# Altium schematic sheet wifi.SchDoc
size A4; DrawnBy: Van Tuan Ngo; Organization: PIF Club; Address1: 304B1, HCMUT,; Address2: Ly Thuong Kiet St.,; Address3: District 10, HCM, VN; DocumentNumber: 6; Revision: 1.0.0; SheetNumber: 6; SheetTotal: 8; Project: PIFWRobot
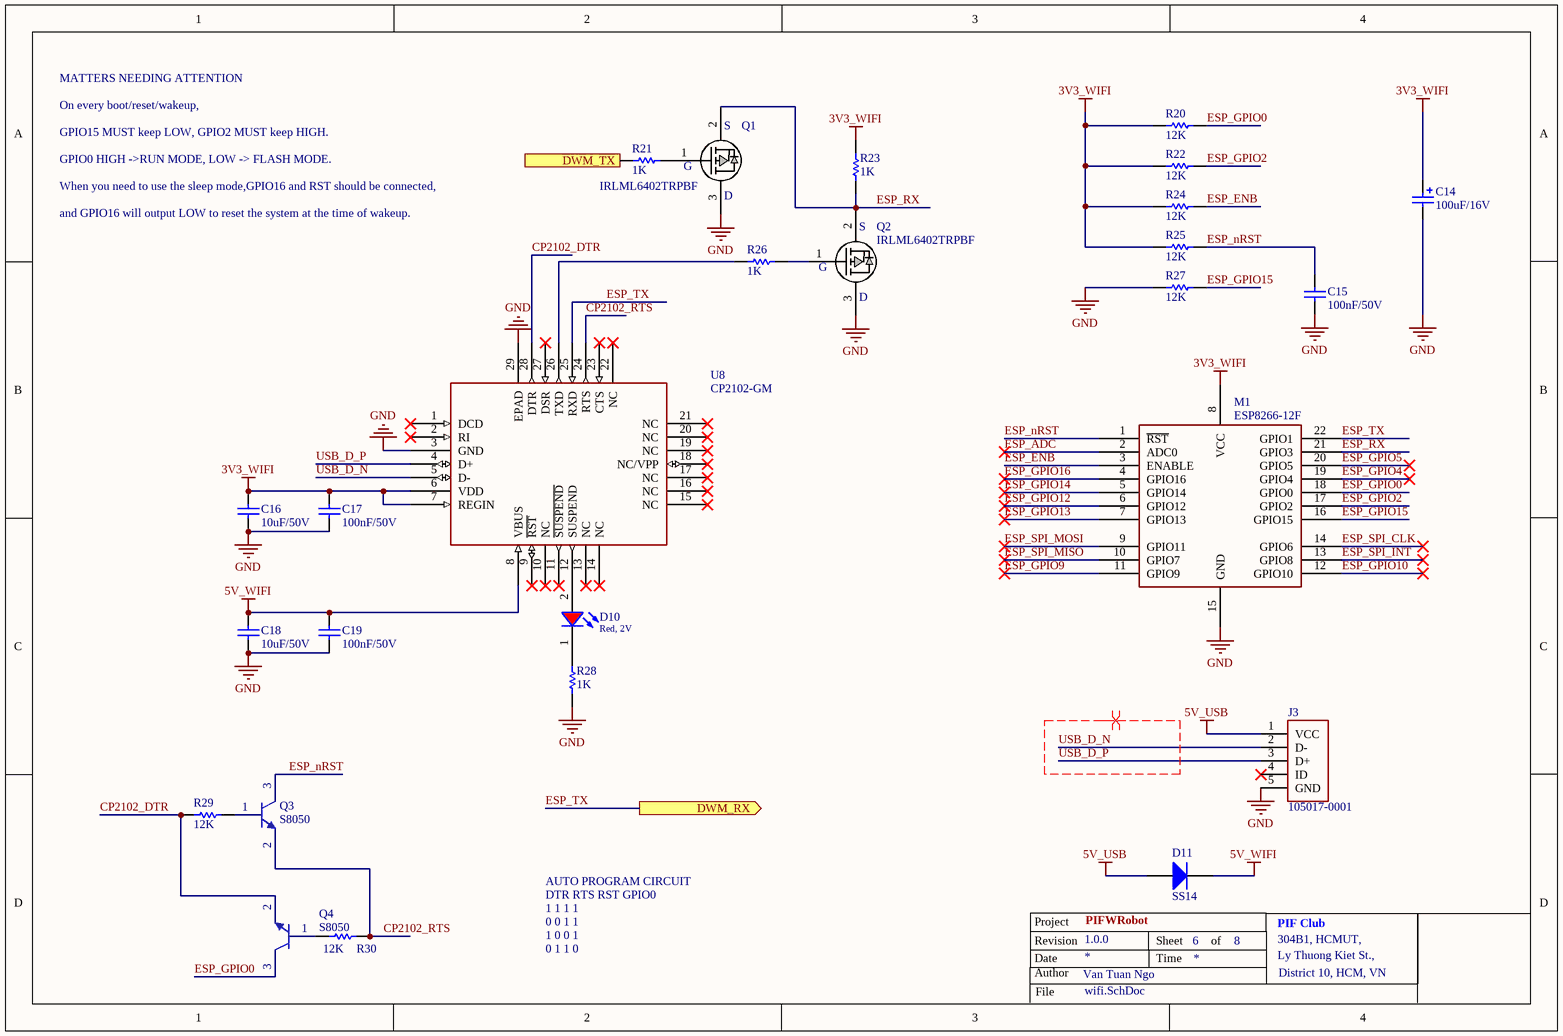
[diagram p0: wifi.SchDoc]

## Parts
C14  value 100uF/16V  [CAP_SM_TAN]  (hidden comment: TAJB107M006RNJ)
C15  value 100nF/50V  [CAP-SM-0805]  (hidden comment: Cap-100nF-50V-0805)
C16  value 10uF/50V  [CAP-SM-0805]  (hidden comment: Cap-10uF-50V-0805)
C17  value 100nF/50V  [CAP-SM-0805]  (hidden comment: Cap-100nF-50V-0805)
C18  value 10uF/50V  [CAP-SM-0805]  (hidden comment: Cap-10uF-50V-0805)
C19  value 100nF/50V  [CAP-SM-0805]  (hidden comment: Cap-100nF-50V-0805)
D10  Red, 2V  [WL-SMCW_0805]
D11  SS14  [SS14]
J3  105017-0001  [Micro-USB-Female]
M1  ESP8266-12F  [ESP8266-12F]
Q1  IRLML6402TRPBF  [SOT23_NEX]
Q2  IRLML6402TRPBF  [SOT23_NEX]
Q3  S8050  [SOT23_NEX]
Q4  S8050  [SOT23_NEX]
R20  value 12K  [RES-SM-0805]  (hidden comment: Res-12K-0805)
R21  value 1K  [RES-SM-0805]  (hidden comment: Res-1K-0805)
R22  value 12K  [RES-SM-0805]  (hidden comment: Res-12K-0805)
R23  value 1K  [RES-SM-0805]  (hidden comment: Res-1K-0805)
R24  value 12K  [RES-SM-0805]  (hidden comment: Res-12K-0805)
R25  value 12K  [RES-SM-0805]  (hidden comment: Res-12K-0805)
R26  value 1K  [RES-SM-0805]  (hidden comment: Res-1K-0805)
R27  value 12K  [RES-SM-0805]  (hidden comment: Res-12K-0805)
R28  value 1K  [RES-SM-0805]  (hidden comment: Res-1K-0805)
R29  value 12K  [RES-SM-0805]  (hidden comment: Res-12K-0805)
R30  value 12K  [RES-SM-0805]  (hidden comment: Res-12K-0805)
U8  CP2102-GM  [QFN28_5X5_SIL]

## Ports
DWM_RX (out), DWM_TX (in)

## Nets
3V3_WIFI: C14.1 C16.2 C17.2 M1.8(VCC) R20.1 R22.1 R23.2 R24.1 R25.1 U8.6(VDD) U8.7(REGIN)
5V_USB: D11.2(A) J3.1(VCC)
5V_WIFI: C18.2 C19.2 D11.1(K) U8.8(VBUS)
GND: C14.2 C15.1 C16.1 C17.1 C18.1 C19.1 J3.5(GND) M1.15(GND) Q1.3(D) Q2.3(D) R27.1 R28.1 U8.3(GND) U8.29(EPAD)
CP2102_DTR: Q4.2(E) R29.1 U8.28(DTR)
CP2102_RTS: Q3.2(E) R30.2 U8.24(RTS)
DWM_TX: R21.1 ; port DWM_TX
ESP_ADC: M1.2(ADC0)
ESP_ENB: M1.3(ENABLE) R24.2
ESP_GPIO0: M1.18(GPIO0) Q4.3(C) R20.2
ESP_GPIO2: M1.17(GPIO2) R22.2
ESP_GPIO4: M1.19(GPIO4)
ESP_GPIO5: M1.20(GPIO5)
ESP_GPIO9: M1.11(GPIO9)
ESP_GPIO10: M1.12(GPIO10)
ESP_GPIO12: M1.6(GPIO12)
ESP_GPIO13: M1.7(GPIO13)
ESP_GPIO14: M1.5(GPIO14)
ESP_GPIO15: M1.16(GPIO15) R27.2
ESP_GPIO16: M1.4(GPIO16)
ESP_nRST: C15.2 M1.1(~{RST}) Q3.3(C) R25.2
ESP_RX: M1.21(GPIO3) Q1.2(S) Q2.2(S) R23.1
ESP_SPI_CLK: M1.14(GPIO6)
ESP_SPI_INT: M1.13(GPIO8)
ESP_SPI_MISO: M1.10(GPIO7)
ESP_SPI_MOSI: M1.9(GPIO11)
ESP_TX: M1.22(GPIO1) U8.25(RXD) ; port DWM_RX
USB_D_N: J3.2(D-) U8.5(D-)
USB_D_P: J3.3(D+) U8.4(D+)
NetD10_1: D10.1(K) R28.2
NetD10_2: D10.2(A) U8.12(SUSPEND)
NetQ1_1: Q1.1(G) R21.2
NetQ2_1: Q2.1(G) R26.2
NetQ3_1: Q3.1(B) R29.2
NetQ4_1: Q4.1(B) R30.1
NetR26_1: R26.1 U8.26(TXD)

Not connected (* = marked no-connect by the designer): J3 4(ID)*; U8 1(DCD)* 2(RI)* 9(~{RST})* 10(NC)* 11(~{SUSPEND})* 13(NC)* 14(NC)* 15(NC)* 16(NC)* 17(NC)* 18(NC/VPP)* 19(NC)* 20(NC)* 21(NC)* 22(NC)* 23(CTS)* 27(DSR)*

## Layout directives
differential pair: USB_D_N, USB_D_P

## Notes on the sheet
- MATTERS NEEDING ATTENTION
- On every boot/reset/wakeup,
- GPIO15 MUST keep LOW, GPIO2 MUST keep HIGH.
- GPIO0 HIGH ->RUN MODE, LOW -> FLASH MODE.
- When you need to use the sleep mode,GPIO16 and RST should be connected,
- and GPIO16 will output LOW to reset the system at the time of wakeup.
- AUTO PROGRAM CIRCUIT
- DTR RTS RST GPIO0
- 1 1 1 1
- 0 0 1 1
- 1 0 0 1
- 0 1 1 0
- Project
- Revision
- Date
- Author
- Sheet
- Time
- of
- File

## Library data of the parts
C14 = Cap-Tan-100uF-16V: Manufacturer: Nichicon; Manufacturer Part Number: UWX1C101MCL1GB; Local Supplier: thegioiic; Local Supplier Link: https://www.thegioiic.com/products/tu-tantalum-100uf-16v-2312-tajc107k016rnj; Supplier 1: Digikey; Supplier 1 Part Number: 493-2105-1-ND; Supplier 1 Link: https://www.digikey.com/product-detail/en/nichicon/UWX1C101MCL1GB/493-2105-1-ND/590080
C15 C17 C19 = Cap-100nF-50V-0805: CAP CER 0.1UF 50V Y5V 0805; Manufacturer: Samsung Electro-Mechanics; Manufacturer Part Number: CL21F104ZBCNNNC; Local Supplier: thegioiic; Supplier 1: Digikey; Supplier 1 Part Number: 1276-1007-1-ND; Supplier 1 Link: https://www.digikey.com/product-detail/en/samsung-electro-mechanics/CL21F104ZBCNNNC/1276-1007-1-ND/3889093
  C15: Local Supplier Link: https://thegioiic.com/products/tu-100nf-0-1uf-50v-0805
  C17 C19: Local Supplier Link: https://www.thegioiic.com/products/tu-gom-0805-100nf-0-1uf-50v
C16 C18 = Cap-10uF-50V-0805: CAP CER 10UF 50V X5R 0805; Manufacturer: Yageo; Manufacturer Part Number: CC0805KKX5R9BB106; Local Supplier: thegioiic; Local Supplier Link: https://www.thegioiic.com/products/tu-gom-0805-10uf-50v; Supplier 1: Digikey; Supplier 1 Link: https://www.digikey.com/product-detail/en/yageo/CC0805KKX5R9BB106/311-3499-2-ND/7164383; Supplier 1 Part Number: 311-3499-2-ND
D10 = 0805-Red: WL-SMCW SMT Mono-color Chip LED Waterclear, size 0805, Red, 2V, 140deg; Part Number: 150080RS75000; Chip Technology: AlInGaP; Dominant Wavelength typ.: 625nm; Luminous Intensity typ.: 150mcd; Peak Wavelength typ.: 630nm; Viewing Angle: 140deg; ComponentLink1Description: Manufacturer; ComponentLink1URL: http://www.we-online.de; ComponentLink2URL: https://www.we-online.com/catalog/datasheet/150080RS75000.pdf; ComponentLink2Description: Datasheet; Forward Voltage typ.: 2V; Emitting Color: Red; Mounting Technology: SMT; Operating Temperature: -40 to +85degC; Published Date: December 2019; Packaging: Tape and Reel; Size: 0805; Publisher: Wurth Elektronik; Local Supplier: thegioiic; Local Supplier Partnumber: x; Local Supplier Link: https://www.thegioiic.com/products/led-do-0805-dan-smd-trong-suot-harvatek
D11 = Diode-SS14: DIODE SCHOTTKY 40V 1A SMA; Manufacturer: ON Semiconductor; Local Supplier: thegioiic; Local Supplier Link: https://www.thegioiic.com/products/ss14-sma-diode-schottky-1a-1n5819; Supplier 1: Digikey; Supplier 1 Link: https://www.digikey.com/product-detail/en/on-semiconductor/SS14/SS14CT-ND/965729; Manufacturer Part Number: SS14; Supplier 1 Part Number: SS14CT-ND
J3 = Micro-USB-Female: CONN RCPT USB2.0 MICRO B SMD R/A; Vendor: Molex Connector Corporation; Built_By: EMA_Cory; SourceLibrary: Molex_2020-05-26; Datasheet: https://www.molex.com/pdm_docs/sd/1050170001_sd.pdf; Manufacturer_Part_Number: 105017-0001; Copyright: Copyright (C) 2018 Accelerated Designs. All rights reserved; RefDes: RefDes; Type: DEV; Local Supplier: thegioiic; Local Supplier Part Number: x; Local Supplier Link: https://www.thegioiic.com/products/cong-usb-micro-b-2-0-dau-cai-5-chan-smd-v1
Q1 Q2 = IRLML6402TRPBF: P-Channel 20V 3.7A (Ta) 1.3W (Ta) Surface Mount Micro3™/SOT-23; Local Supplier: thegioiic; Local Supplier Link: https://www.thegioiic.com/products/irlml6402trpbf; Local Supplier Part Number: *
R20 R22 R24 R25 R27 R29 R30 = Res-12K-0805: RES 12 KOHM JUMPER 0805; Manufacturer: Vishay Thin Film; Manufacturer Part Number: PAT0805E3121BST1; Local Supplier: icdayroi; Local Supplier Link: https://icdayroi.com/dien-tro-12k-0805-1-goi-50-con; Supplier 1: Digikey; Supplier 1 Link: https://www.digikey.com/product-detail/en/vishay-thin-film/PAT0805E3121BST1/PAT0805E3121BST1-ND/2281536; Supplier 1 Part Number: PAT0805E3121BST1-ND
R21 R23 R26 R28 = Res-1K-0805: RES 1K OHM 1% 1/4W 0805; Manufacturer: Stackpole Electronics Inc; Manufacturer Part Number: RNCP0805FTD1K00; Local Supplier: thegioiic; Local Supplier Link: https://www.thegioiic.com/products/dien-tro-1-kohm-0805-5; Supplier 1: Digikey; Supplier 1 Link: https://www.digikey.com/product-detail/en/stackpole-electronics-inc/RNCP0805FTD1K00/RNCP0805FTD1K00CT-ND/2240568; Supplier 1 Part Number: RNCP0805FTD1K00CT-ND
U8 = CP2102-GM: Vendor: Silicon Labs; Built_By: EMA_UL_Team; SourceLibrary: Silicon_Labs_2015-03-23; Manufacturer_Part_Number: CP2102-GM; Copyright: Copyright (C) 2018 Accelerated Designs. All rights reserved; RefDes: RefDes; Type: DEV; Local Supplier: thegioiic; Local Supplier Part Number: *; Local Supplier Link: https://www.thegioiic.com/products/cp2102
M1 = ESP8266-12F: Manufacturer: *; Manufacturer Part Number: *; Local Supplier: thegioiic; Local Supplier Link: https://www.thegioiic.com/products/esp-12f-esp8266-mach-thu-phat-wifi; Local Supplier Part Number: x
Q3 Q4 = S8050: Local Supplier: thegioiic; Local Supplier Part Number: *; Local Supplier Link: https://www.thegioiic.com/products/mmss8050-h-tp